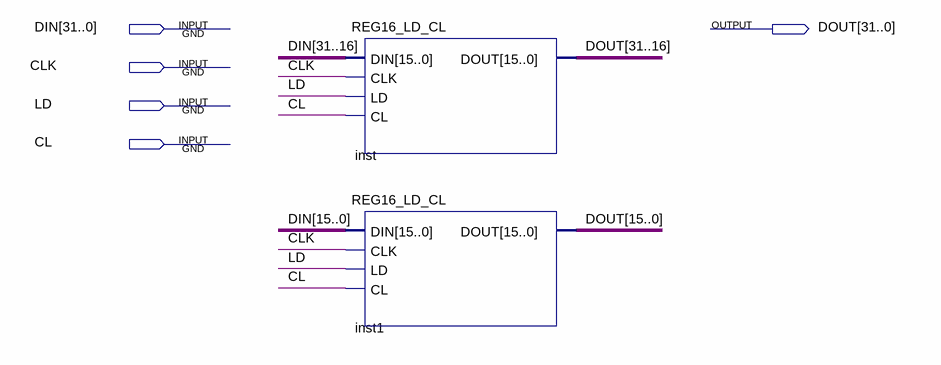
[diagram p0: schematic sheet]
// Quartus schematic REG32_LD_CL.bdf as structural Verilog: 2 symbols, 5 pins
module REG32_LD_CL (
  input  [31:0] DIN,
  input  CLK,
  input  LD,
  input  CL,
  output [31:0] DOUT
);

  REG16_LD_CL inst (.DIN(DIN[31:16]), .CLK(CLK), .LD(LD), .CL(CL), .DOUT(DOUT[31:16]));
  REG16_LD_CL inst1 (.DIN(DIN[15:0]), .CLK(CLK), .LD(LD), .CL(CL), .DOUT(DOUT[15:0]));
endmodule
